# EAGLE design HW-DC25-Badge-20170609-1.2 (EAGLE 7.6.0)
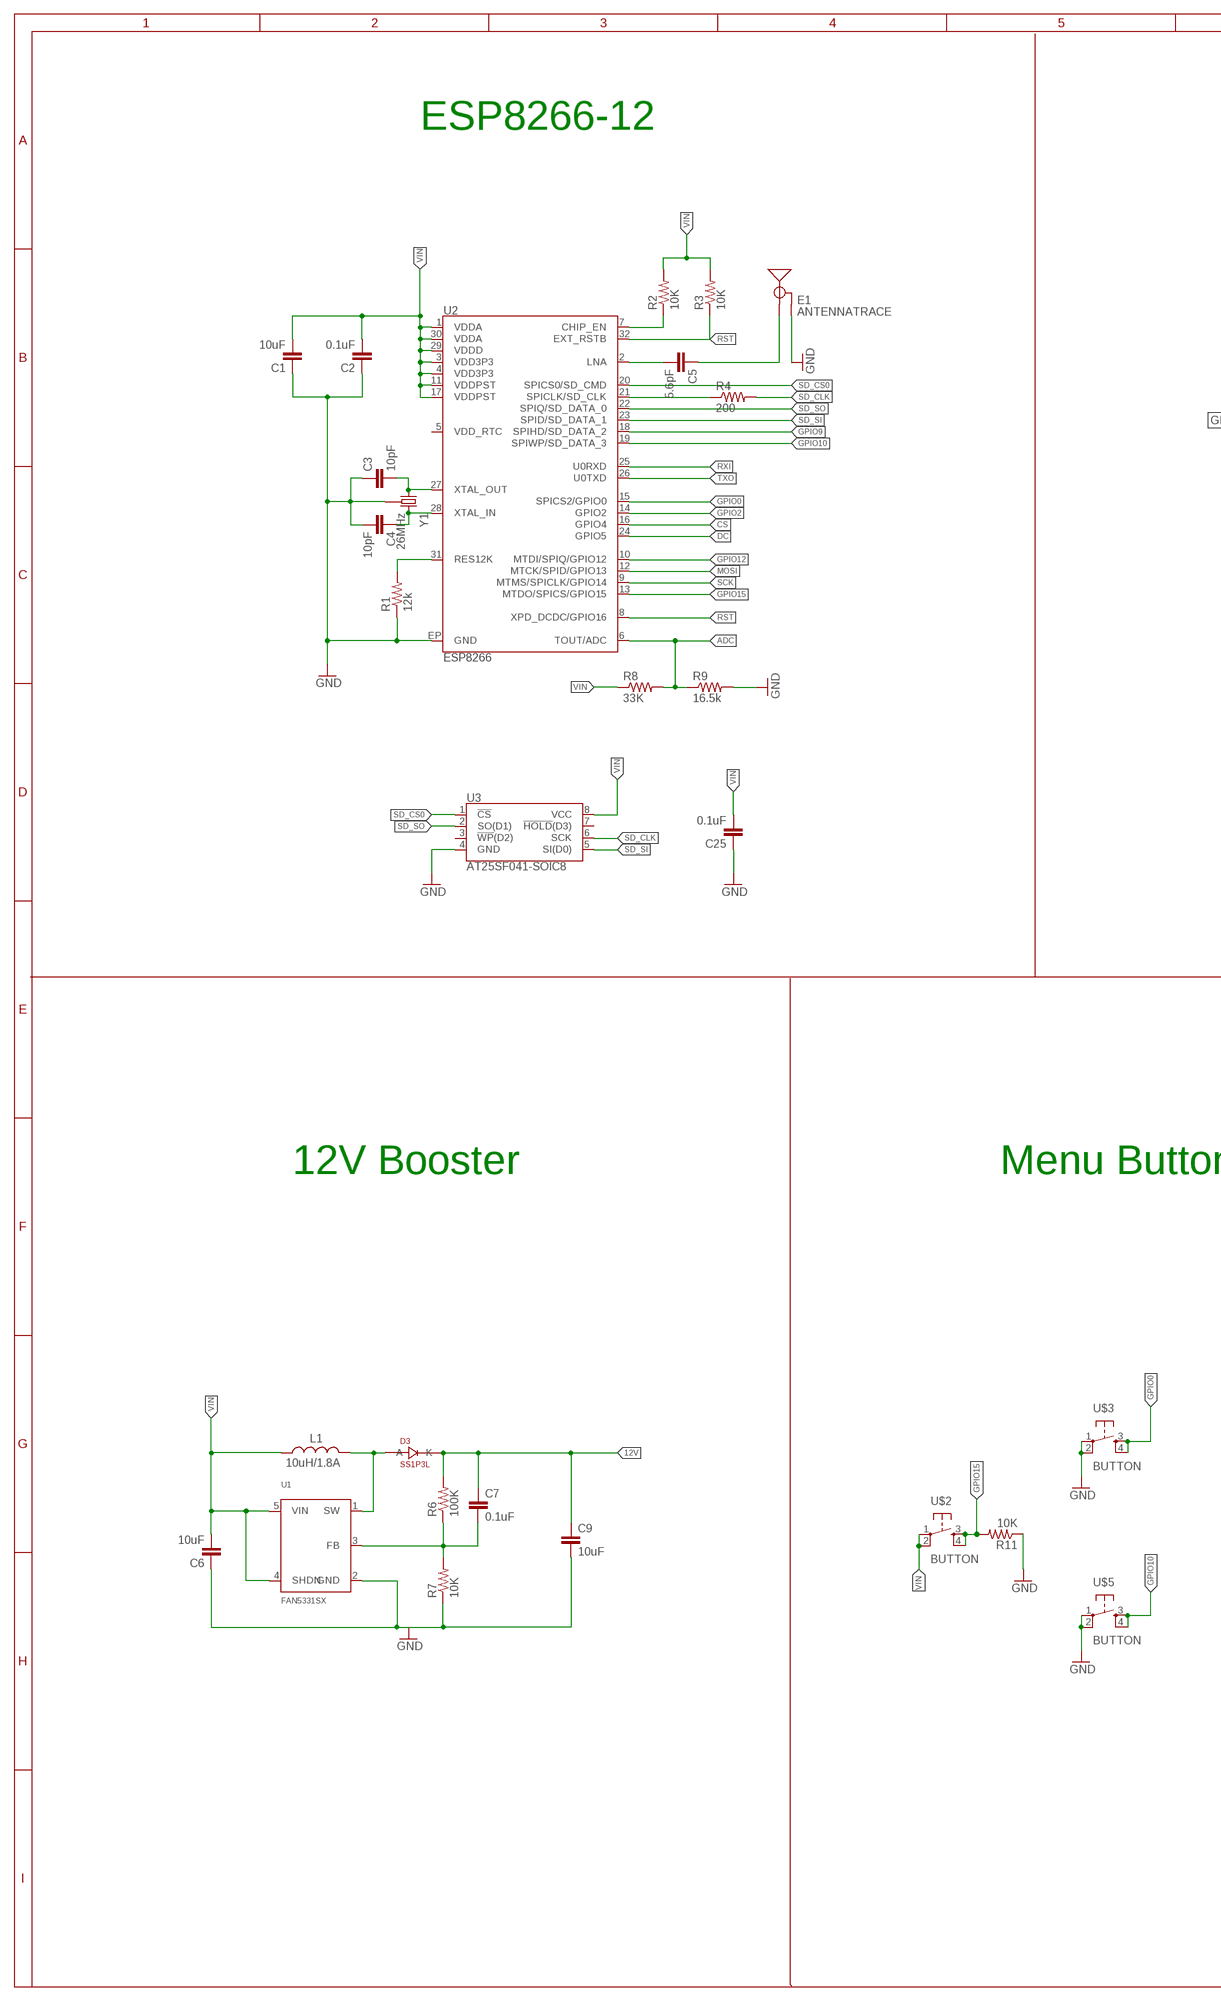
[diagram p0: schematic, sheet 1, part 1 of 2]
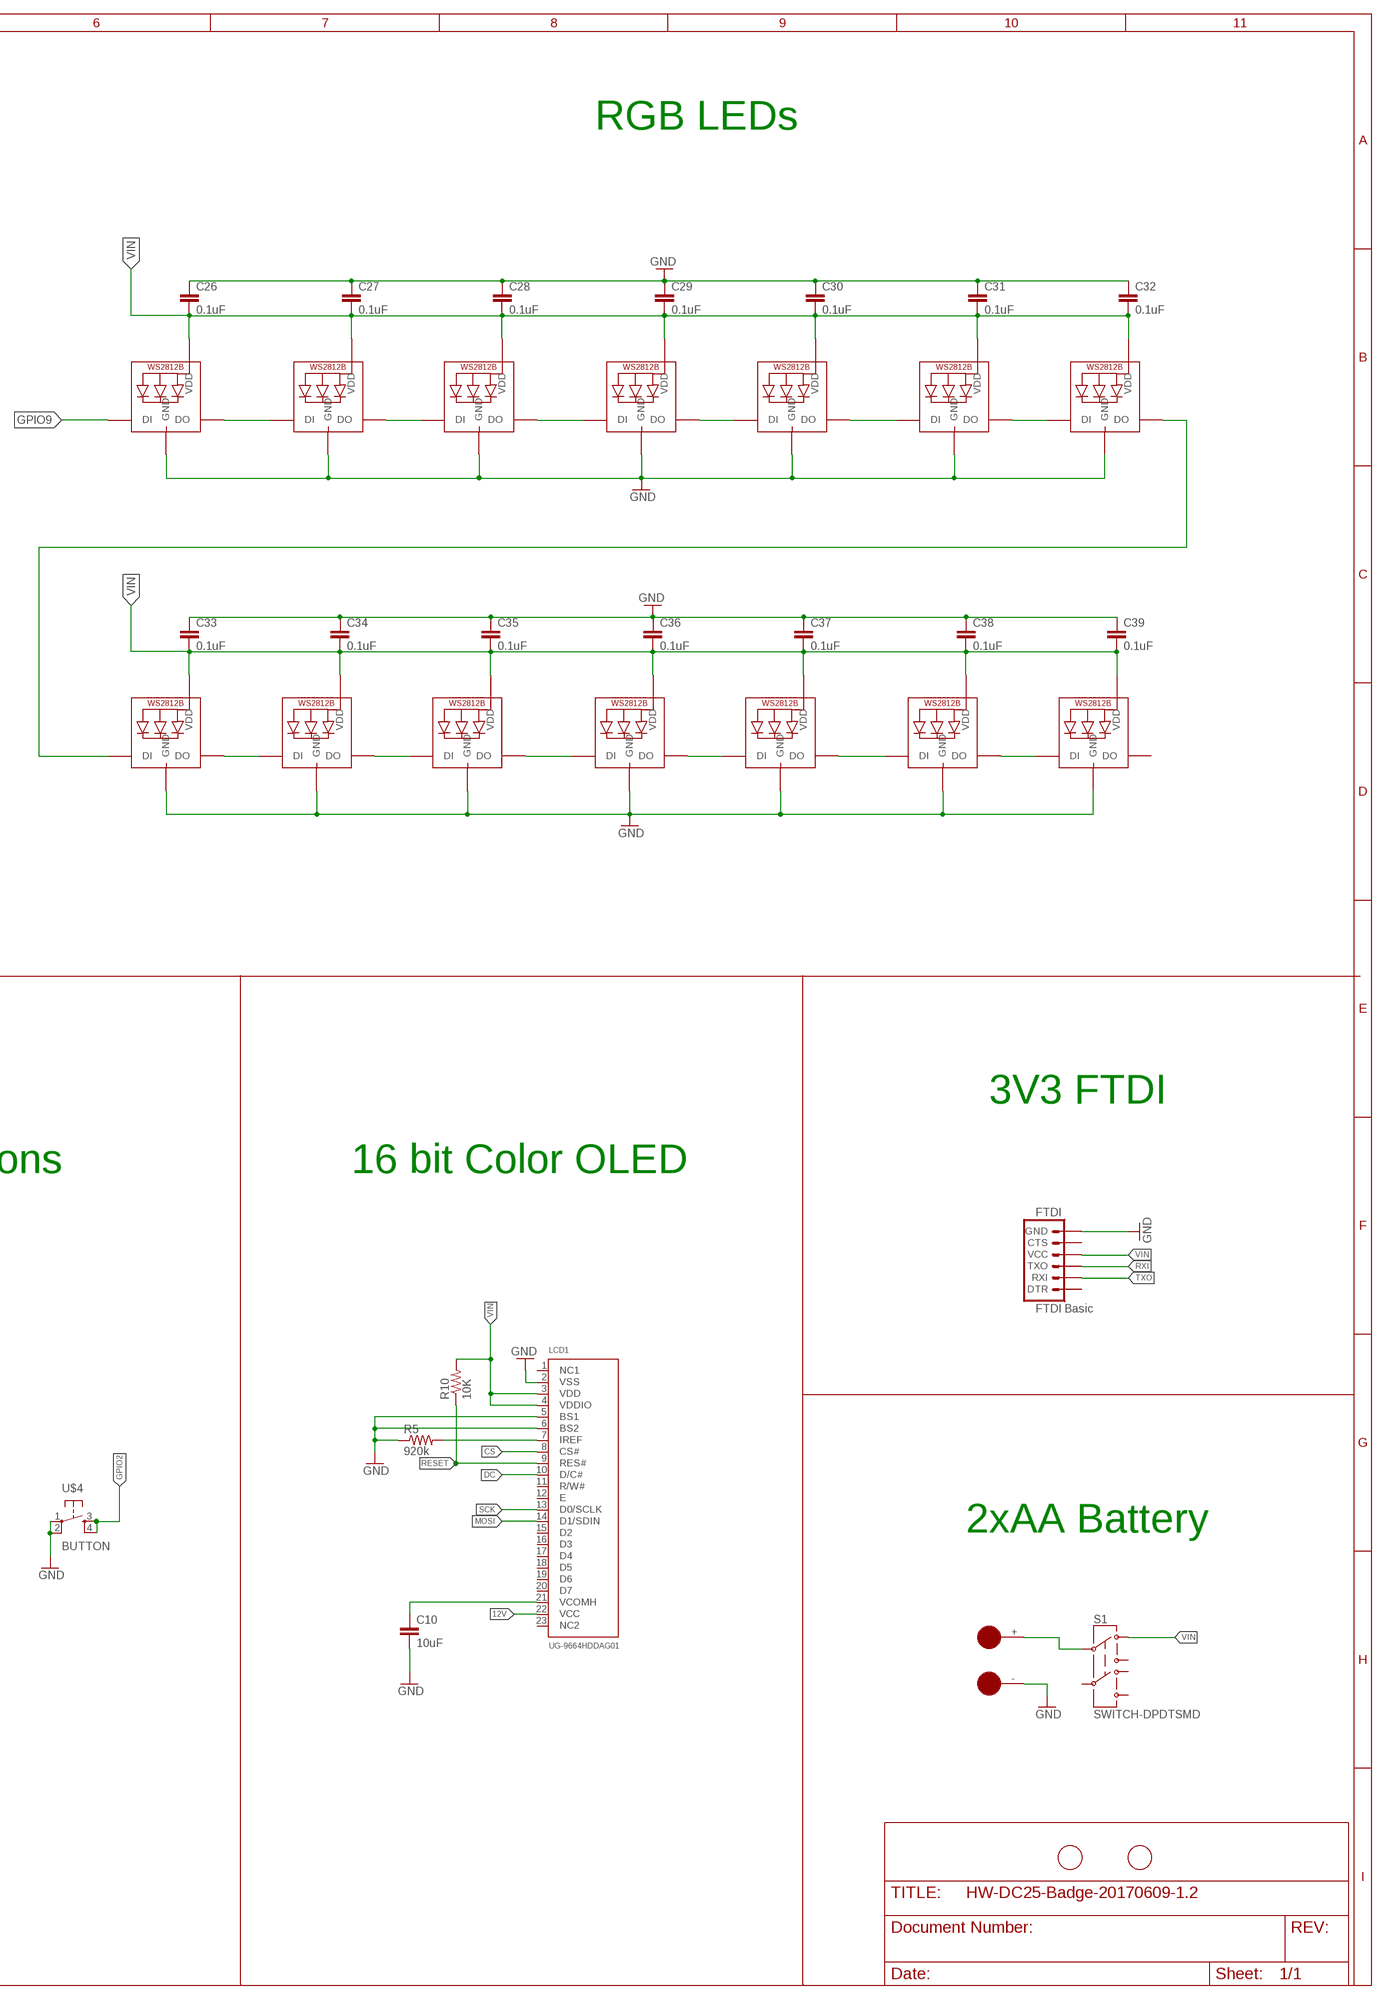
[diagram p1: schematic, sheet 1, part 2 of 2]

## Parts
C1  10uF  CAP-0603-10UF-10V-10%  [CAP0603]
C2  0.1uF  CAP-0603-10UF-10V-10%  [CAP0603]
C3  10pF  CAP-0603-0.01UF-50V-10%  [CAP0603]
C4  10pF  CAP-0603-0.01UF-50V-10%  [CAP0603]
C5  5.6pF  CAP-0603-EMPTY-VALUES  [CAP0603]
C6  10uF  CAP-0603-10UF-10V-10%  [CAP0603]
C7  0.1uF  CAP-0603-0.1UF-25V-10%  [CAP0603]
C9  10uF  CAP-0603-10UF-25V-20%  [CAP0603]
C10  10uF  CAP-0603-10UF-25V-20%  [CAP0603]
C25  0.1uF  CAP-0603-10UF-10V-10%  [CAP0603]
C26  0.1uF  CAP-0402-0.1UF-16V-10%  [CAP0402]
C27  0.1uF  CAP-0402-0.1UF-16V-10%  [CAP0402]
C28  0.1uF  CAP-0402-0.1UF-16V-10%  [CAP0402]
C29  0.1uF  CAP-0402-0.1UF-16V-10%  [CAP0402]
C30  0.1uF  CAP-0402-0.1UF-16V-10%  [CAP0402]
C31  0.1uF  CAP-0402-0.1UF-16V-10%  [CAP0402]
C32  0.1uF  CAP-0402-0.1UF-16V-10%  [CAP0402]
C33  0.1uF  CAP-0402-0.1UF-16V-10%  [CAP0402]
C34  0.1uF  CAP-0402-0.1UF-16V-10%  [CAP0402]
C35  0.1uF  CAP-0402-0.1UF-16V-10%  [CAP0402]
C36  0.1uF  CAP-0402-0.1UF-16V-10%  [CAP0402]
C37  0.1uF  CAP-0402-0.1UF-16V-10%  [CAP0402]
C38  0.1uF  CAP-0402-0.1UF-16V-10%  [CAP0402]
C39  0.1uF  CAP-0402-0.1UF-16V-10%  [CAP0402]
D3  SS1P3L  [DO220AAL]
E1  ANTENNATRACE  [TRACE_ANTENNA_2.4GHZ_25.7MM]
FTDI  FTDI Basic  ARDUINO_SERIAL_PROGRAMPTH  [1X06]
L1  10uH/1.8A  INDUCTORSRU5028  [SRU5028]
LCD1  UG-9664HDDAG01  DISP_OLED_UG-9664HDDAG01WRAPAROUND  [UG-9664HDDAG01_WRAPAROUND]
LED1  WS2812B3535  [LED3535]
LED2  WS2812B3535  [LED3535]
LED3  WS2812B3535  [LED3535]
LED4  WS2812B3535  [LED3535]
LED5  WS2812B3535  [LED3535]
LED6  WS2812B3535  [LED3535]
LED7  WS2812B3535  [LED3535]
LED8  WS2812B3535  [LED3535]
LED9  WS2812B3535  [LED3535]
LED10  WS2812B3535  [LED3535]
LED11  WS2812B3535  [LED3535]
LED12  WS2812B3535  [LED3535]
LED13  WS2812B3535  [LED3535]
LED14  WS2812B3535  [LED3535]
R1  12k  RES-0603_EMPTY-FIELDS  [RES-0603]
R2  10K  RES-0603-10K-5%  [RES-0603]
R3  10K  RES-0603-10K-5%  [RES-0603]
R4  200  RES-0603_EMPTY-FIELDS  [RES-0603]
R5  920k  RES-0603_EMPTY-FIELDS  [RES-0603]
R6  100K  RES-0603-100K-5%  [RES-0603]
R7  10K  RES-0603-10K-5%  [RES-0603]
R8  33K  RES-0603-33K-1%  [RES-0603]
R9  16.5k  RES-0603-10K-5%  [RES-0603]
R10  10K  RES-0603-10K-5%  [RES-0603]
R11  10K  RES-0603-10K-5%  [RES-0603]
S1  SWITCH-DPDTSMD  [AYZ0202]
U1  FAN5331SX  FAN5331  [SOT23-5]
U2  ESP8266  [QFN32]
U3  AT25SF041-SOIC8  [SO08]
U$1  BAT_HOLD  [AA]
U$2  BUTTON  [BUTTON]
U$3  BUTTON  [BUTTON]
U$4  BUTTON  [BUTTON]
U$5  BUTTON  [BUTTON]
U$6  FIDUCIAL  [FIDUCIAL_1MM]
U$7  FIDUCIAL  [FIDUCIAL_1MM]
Y1  26MHz  CRYSTAL-GROUNDED3.2X2.5  [CRYSTAL-SMD-3.2X2.5]

## Nets
12V: C7.1 C9.1 D3.P$1(K) LCD1.22(VCC) R6.2
ADC: R8.2 R9.1 U2.6(TOUT/ADC)
CS: LCD1.8(CS#) U2.16(GPIO4)
DC: LCD1.10(D/C#) U2.24(GPIO5)
GND: C1.1 C2.1 C3.1 C4.2 C6.1 C9.2 C10.2 C25.1 C26.P$1 C27.P$1 C28.P$1 C29.P$1 C30.P$1 C31.P$1 C32.P$1 C33.P$1 C34.P$1 C35.P$1 C36.P$1 C37.P$1 C38.P$1 C39.P$1 E1.GND E1.GND2(GND) FTDI.6(GND) LCD1.2(VSS) LCD1.5(BS1) LCD1.6(BS2) LED1.4(GND) LED2.4(GND) LED3.4(GND) LED4.4(GND) LED5.4(GND) LED6.4(GND) LED7.4(GND) LED8.4(GND) LED9.4(GND) LED10.4(GND) LED11.4(GND) LED12.4(GND) LED13.4(GND) LED14.4(GND) R1.1 R5.1 R7.1 R9.2 R11.1 U1.2(GND) U2.EP(GND) U3.4(GND) U$1.- U$3.1 U$3.2 U$4.1 U$4.2 U$5.1 U$5.2 Y1.2(GND) Y1.4(GND)
GPIO0: U2.15(SPICS2/GPIO0) U$3.3 U$3.4
GPIO2: U2.14(GPIO2) U$4.3 U$4.4
GPIO9: LED1.1(DI) U2.18(SPIHD/SD_DATA_2)
GPIO10: U2.19(SPIWP/SD_DATA_3) U$5.3 U$5.4
GPIO12: U2.10(MTDI/SPIQ/GPIO12)
GPIO15: R11.2 U2.13(MTDO/SPICS/GPIO15) U$2.3 U$2.4
MOSI: LCD1.14(D1/SDIN) U2.12(MTCK/SPID/GPIO13)
N$1: C3.2 U2.27(XTAL_OUT) Y1.1
N$2: C4.1 U2.28(XTAL_IN) Y1.3
N$3: C5.2 U2.2(LNA)
N$4: C5.1 E1.ANT(SIGNAL)
N$5: R1.2 U2.31(RES12K)
N$6: R2.1 U2.7(CHIP_EN)
N$7: D3.P$2(A) L1.2 U1.1(SW)
N$8: R4.1 U2.21(SPICLK/SD_CLK)
N$9: LCD1.7(IREF) R5.2
N$10: S1.2 U$1.+
N$11: C7.2 R6.1 R7.2 U1.3(FB)
N$12: C10.1 LCD1.21(VCOMH)
N$14: LED1.3(DO) LED2.1(DI)
N$15: LED2.3(DO) LED3.1(DI)
N$16: LED3.3(DO) LED4.1(DI)
N$17: LED4.3(DO) LED5.1(DI)
N$18: LED5.3(DO) LED6.1(DI)
N$19: LED6.3(DO) LED7.1(DI)
N$20: LED7.3(DO) LED8.1(DI)
N$21: LED8.3(DO) LED9.1(DI)
N$22: LED9.3(DO) LED10.1(DI)
N$23: LED10.3(DO) LED11.1(DI)
N$24: LED11.3(DO) LED12.1(DI)
N$25: LED12.3(DO) LED13.1(DI)
N$26: LED13.3(DO) LED14.1(DI)
RESET: LCD1.9(RES#) R10.1
RST: R3.1 U2.8(XPD_DCDC/GPIO16) U2.32(EXT_RSTB)
RXI: FTDI.3(TXO) U2.25(U0RXD)
SCK: LCD1.13(D0/SCLK) U2.9(MTMS/SPICLK/GPIO14)
SD_CLK: R4.2 U3.6(SCK)
SD_CS0: U2.20(SPICS0/SD_CMD) U3.1(!CS!)
SD_SI: U2.23(SPID/SD_DATA_1) U3.5(SI(D0))
SD_SO: U2.22(SPIQ/SD_DATA_0) U3.2(SO(D1))
TXO: FTDI.2(RXI) U2.26(U0TXD)
VIN: C1.2 C2.2 C6.2 C25.2 C26.P$2 C27.P$2 C28.P$2 C29.P$2 C30.P$2 C31.P$2 C32.P$2 C33.P$2 C34.P$2 C35.P$2 C36.P$2 C37.P$2 C38.P$2 C39.P$2 FTDI.4(VCC) L1.1 LCD1.3(VDD) LCD1.4(VDDIO) LED1.2(VDD) LED2.2(VDD) LED3.2(VDD) LED4.2(VDD) LED5.2(VDD) LED6.2(VDD) LED7.2(VDD) LED8.2(VDD) LED9.2(VDD) LED10.2(VDD) LED11.2(VDD) LED12.2(VDD) LED13.2(VDD) LED14.2(VDD) R2.2 R3.2 R8.1 R10.2 S1.1 U1.4(SHDN) U1.5(VIN) U2.1(VDDA) U2.3(VDD3P3) U2.4(VDD3P3) U2.11(VDDPST) U2.17(VDDPST) U2.29(VDDD) U2.30(VDDA) U3.8(VCC) U$2.1 U$2.2
Unconnected: FTDI.1(DTR) FTDI.5(CTS) LCD1.1(NC1) LCD1.11(R/W#) LCD1.12(E) LCD1.15(D2) LCD1.16(D3) LCD1.17(D4) LCD1.18(D5) LCD1.19(D6) LCD1.20(D7) LCD1.23(NC2) LED14.3(DO) S1.3 S1.4 S1.5 S1.6 U2.5(VDD_RTC) U3.3(!WP!(D2)) U3.7(!HOLD!(D3))

## Notes on the sheet
- ESP8266-12 | RGB LEDs
- 3V3 FTDI
- 12V Booster | Menu Buttons | 16 bit Color OLED
- 2xAA Battery

## Library data of the parts
C1 C6 = Jaycon OPL Capacitors:CAP-0603: Jaycon Systems OPL Capacitors 0603 Package. The name for the part has the Value - Voltage - Tolerance making part selection simple.; JAYCON: CP-0070; MFG#1: GRM188R61A106KE69D; SIZE: 0603; TEMPERATURE-COEFFICIENT: X5R; TOLERANCE: 10%; VOLTAGE: 10V
C2 C25 = Jaycon OPL Capacitors:CAP-0603: Jaycon Systems OPL Capacitors 0603 Package. The name for the part has the Value - Voltage - Tolerance making part selection simple.; JAYCON: CP-0070; MFG#1: GRM188R61A106KE69D; SIZE: 0603; TEMPERATURE-COEFFICIENT: X5R; TOLERANCE: 10%; VALUE: 10uF; VOLTAGE: 10V
C3 C4 = Jaycon OPL Capacitors:CAP-0603: Jaycon Systems OPL Capacitors 0603 Package. The name for the part has the Value - Voltage - Tolerance making part selection simple.; JAYCON: CP-0032; MFG#1: CC0603KPX7R9BB103; SIZE: 0603; TEMPERATURE-COEFFICIENT: X7R; TOLERANCE: 10%; VALUE: 0.01uF; VOLTAGE: 50V
C5 = Jaycon OPL Capacitors:CAP-0603: Jaycon Systems OPL Capacitors 0603 Package. The name for the part has the Value - Voltage - Tolerance making part selection simple.; SIZE: 0603
C7 = Jaycon OPL Capacitors:CAP-0603: Jaycon Systems OPL Capacitors 0603 Package. The name for the part has the Value - Voltage - Tolerance making part selection simple.; JAYCON: CP-0066; MFG#1: C1608X7R1E104KT; SIZE: 0603; TEMPERATURE-COEFFICIENT: X7R; TOLERANCE: 10%; VOLTAGE: 25V
C9 C10 = Jaycon OPL Capacitors:CAP-0603: Jaycon Systems OPL Capacitors 0603 Package. The name for the part has the Value - Voltage - Tolerance making part selection simple.; JAYCON: CP-0044; MFG#1: CL10A106MA8NRNC; SIZE: 0603; TEMPERATURE-COEFFICIENT: X5R; TOLERANCE: 20%; VOLTAGE: 25V
C26-C39 = Jaycon OPL Capacitors:CAP-0402: Jaycon Systems OPL Capacitors 0402 Package. The name for the part has the Value - Voltage - Tolerance making part selection simple.; JAYCON: CP-0028; MFG#1: GRM155R71C104KA88D; MFG#2: CL05B104KO5NNNC; SIZE: 0402; TEMPERATURE-COEFFICIENT: X7R; TOLERANCE: 10%; VOLTAGE: 16V
D3 = SmartPrj:SS1P3L; OC_NEWARK: unknown
E1 = SparkFun-RF:ANTENNA: Chip antenna Chip antenna with ground or secondary connection. Common with larger metal RF connectors.
FTDI = SparkFun:ARDUINO_SERIAL_PROGRAM
L1 = SparkFun:INDUCTOR: Inductors Basic Inductor/Choke - 0603 and 1206. Footprints are not proven and vary greatly between part numbers.
LCD1 = microbuilder:DISP_OLED_UG-9664HDDAG01: OLED 96x64 Pixel, 0.95" 65K Color
LED1-LED14 = adafruit:WS2812B
R1 R4 R5 = Jaycon OPL Resistors:RES-0603: SMD 0603 Resistor Library; SIZE: 0603; WATTAGE: 0.1W
R2 R3 R7 R10 R11 = Jaycon OPL Resistors:RES-0603: SMD 0603 Resistor Library; JAYCON: RS-0027; ROHM-MFG: MCR03EZPJ103; SAMSUNG-MFG: RC1608J103CS; SIZE: 0603; TOLERANCE: 5%; VISHAY-MFG: CRCW060310K0JNEA; WATTAGE: 0.1W; YAGEO-MFG: RC0603JR-0710KP
R6 = Jaycon OPL Resistors:RES-0603: SMD 0603 Resistor Library; JAYCON: RS-0013; SIZE: 0603; TOLERANCE: 5%; VISHAY-MFG: RCG0603100KJNEA; WATTAGE: 0.1W
R8 = Jaycon OPL Resistors:RES-0603: SMD 0603 Resistor Library; JAYCON: RS-0014; SIZE: 0603; TOLERANCE: 1%; WATTAGE: 0.1W; YAGEO-MFG: RC0603FR-0733KL
R9 = Jaycon OPL Resistors:RES-0603: SMD 0603 Resistor Library; JAYCON: RS-0027; ROHM-MFG: MCR03EZPJ103; SAMSUNG-MFG: RC1608J103CS; SIZE: 0603; TOLERANCE: 5%; VALUE: 10K; VISHAY-MFG: CRCW060310K0JNEA; WATTAGE: 0.1W; YAGEO-MFG: RC0603JR-0710KP
S1 = SparkFun:SWITCH-DPDT: DPDT Version of the COM-00597
U1 = microbuilder:FAN5331: FAN5331 - LED/OLED 20V Boost Converter Digikey: FAN5331SXCT-ND
U2 = esp8266-development-board:ESP8266: Espressif ESP8266 WiFi Smart Connectivity Platform.; PROD_ID: IC-12452
U3 = esp8266-development-board:AT25SF041: SPI Serial Flash Memory with Dual/Quad-IO Support Example: Adesto Technologies AT25SF041-SSHD-T (1265-1131-1-ND) <http://www.digikey.com/product-detail/en/AT25SF041-SSHD-T/1265-1131-1-ND/4824165>; PROD_ID: IC-12455
U$1 = Badge:BAT_HOLD
U$2-U$5 = WiFiButton:BUTTON
U$6 U$7 = adafruit:FIDUCIAL: For use by pick and place machines to calibrate the vision/machine, 1mm By microbuilder.eu
Y1 = things:CRYSTAL-GROUNDED; PROD_ID: XTAL-12454

## Board
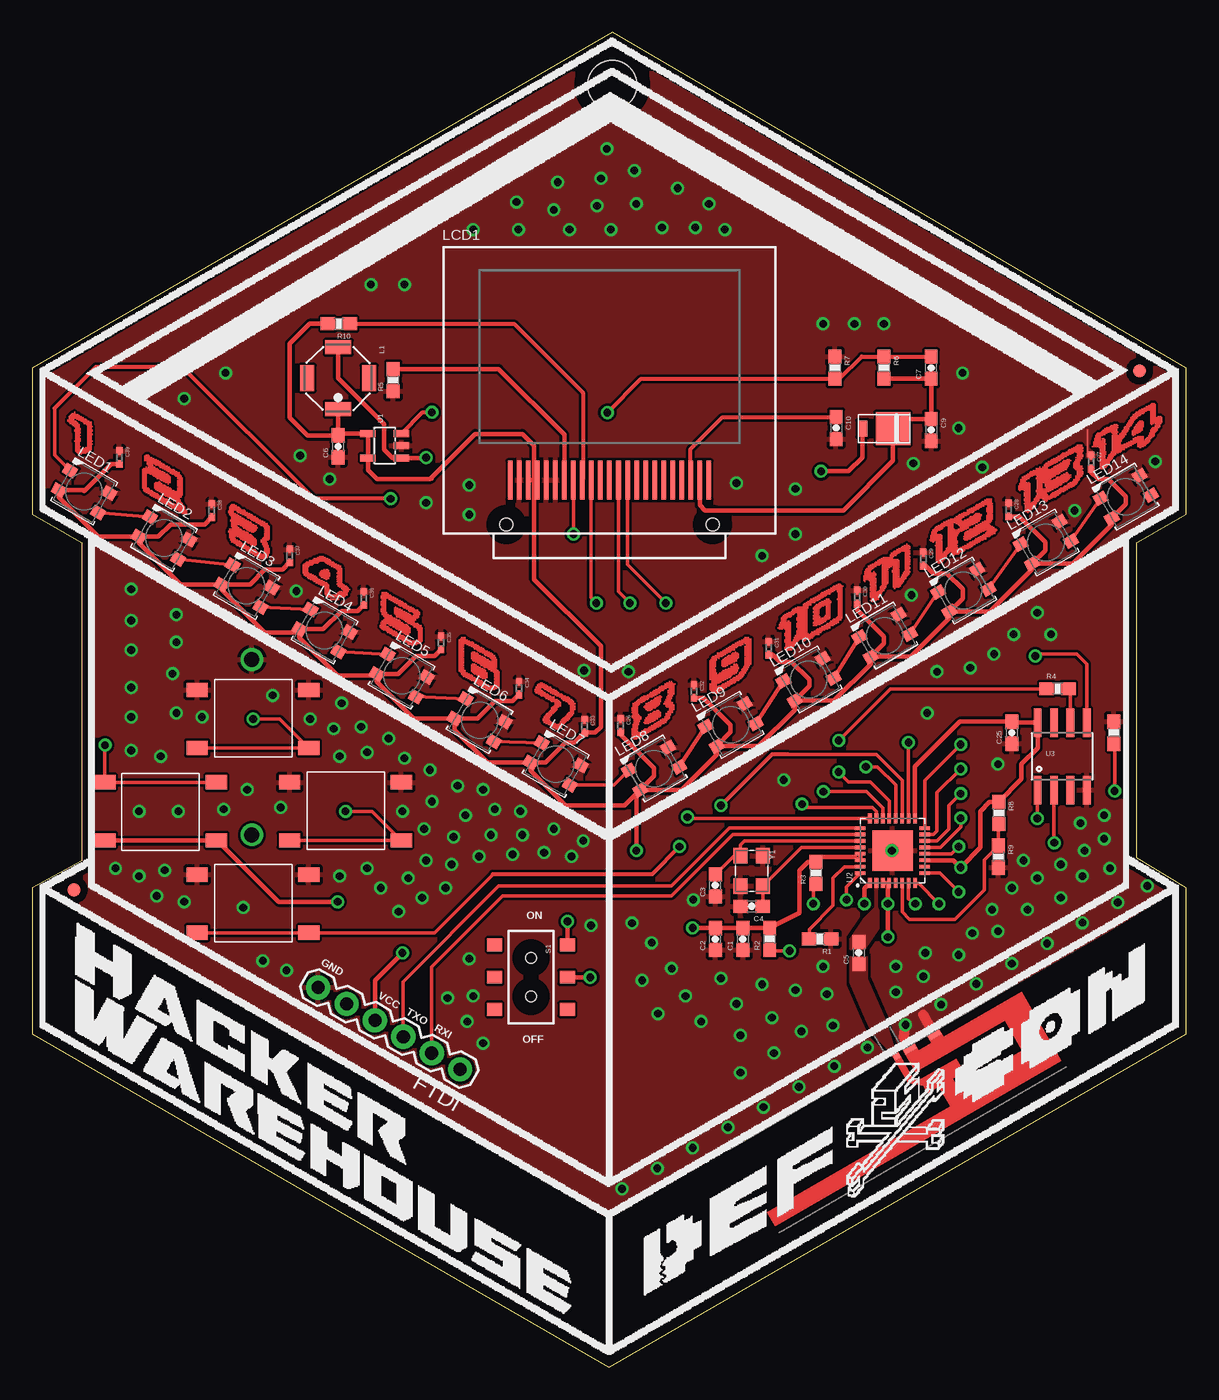
[diagram p2: board, top side]
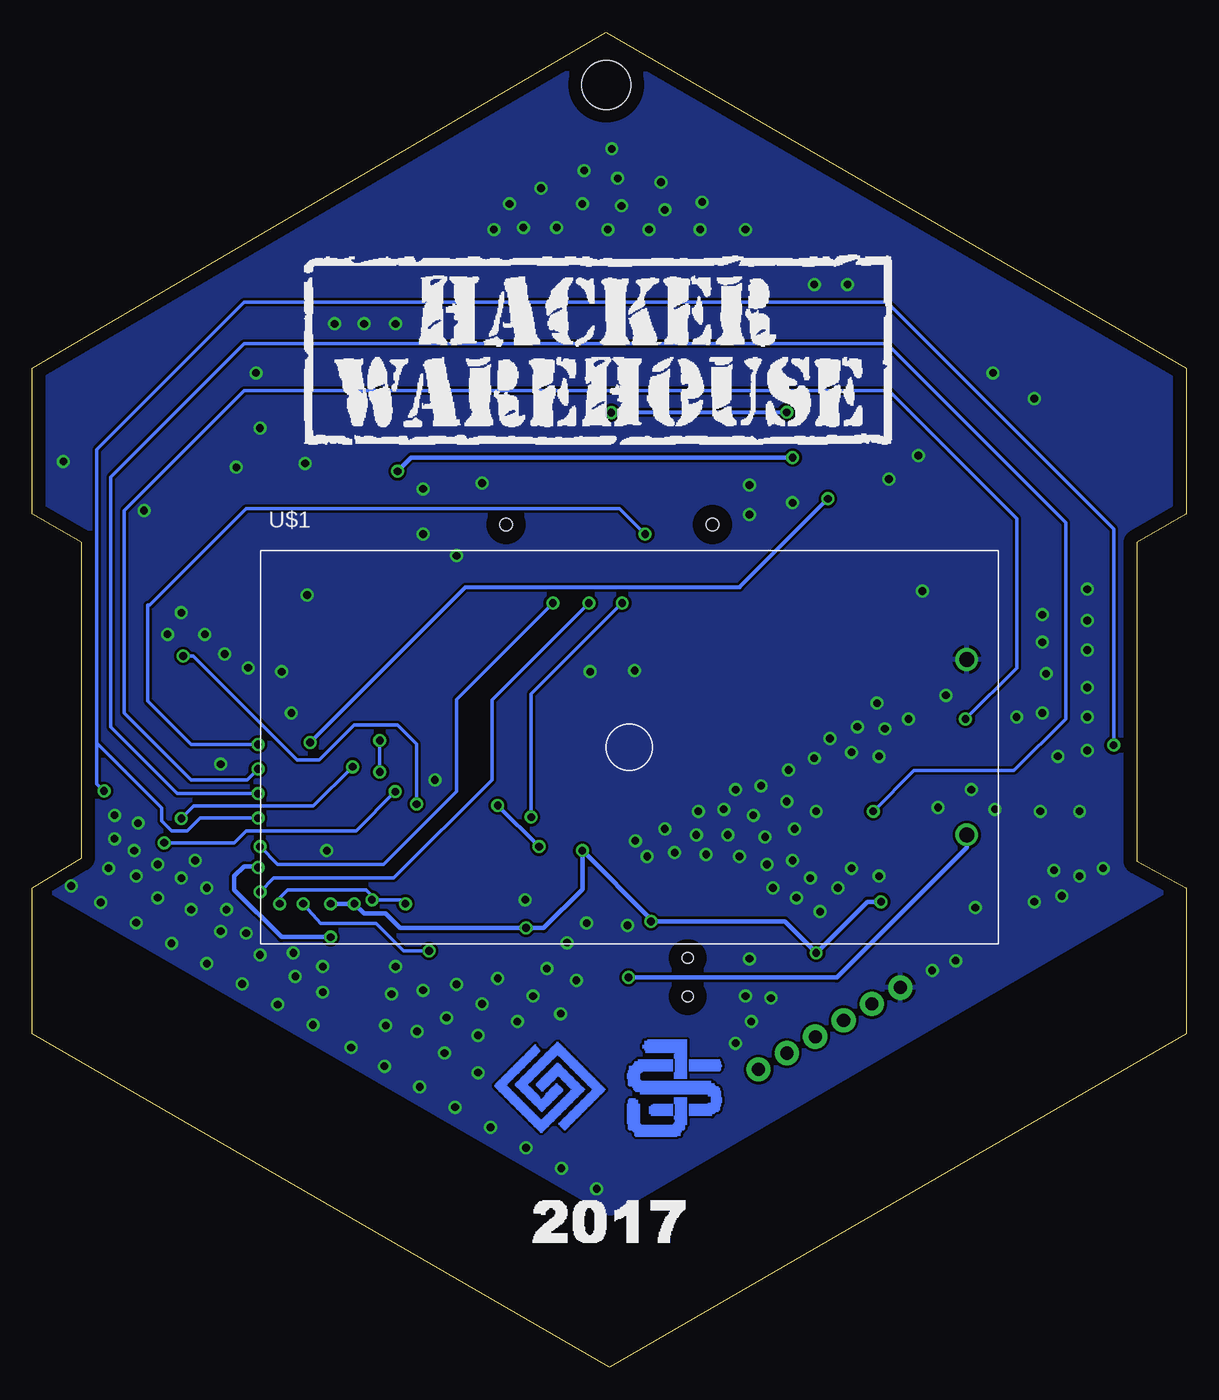
[diagram p3: board, bottom side, seen from below]

Size 89.48 x 103.5 mm. Coordinates in mm from the lower left corner, seen from the top.
Outline: 89.48,66.14 89.48,77.47 44.98,103.51 0,77.47 0,66.14 3.84,63.93 3.84,39.27 0,37.16 0,25.83 44.73,0 89.48,25.83 89.48,37.16 85.65,39.47 85.65,63.93 89.48,66.14
Copper layers (1*16): Top 0.035mm / dielectric 1.5mm / Bottom 0.035mm
Design rules "default *": minimum track width 10mil, minimum drill 24mil, track to track 8mil, track to pad 8mil, pad to pad 8mil, via to via 8mil, smd to smd 8mil, copper to edge 40mil, drill to drill 8mil, minimum pad ring 10mil, minimum via ring 8mil, stop-mask expansion 4mil, vias tented up to drill 24mil, thermal gap 10mil
Holes 3.81 mm at 44.98,99.43

### Footprints (pad centres in the part's own frame; a part is rotated, then mirrored left to right if it is on the bottom)
CAP0603 = smd 1.1 x 1: 1 -0.85,0; 2 0.85,0
CAP0402 = smd 0.599 x 0.5: P$1 -0.5,0; P$2 0.5,0
DO220AAL = smd 2.667 x 2.54: P$1 -0.7,0 | smd 0.762 x 1.27: P$2 1.65,0
TRACE_ANTENNA_2.4GHZ_25.7MM = smd 0.46 x 0.46: ANT 0,0.23 | smd 1 x 0.46: GND -1.18,0.23; GND2 -3.38,0.23
1X06 = drill 1.016 pad 1.88: 1 0,0; 2 2.54,0; 3 5.08,0; 4 7.62,0; 5 10.16,0; 6 12.7,0
SRU5028 = smd 1.1 x 2: 1 2.4,0; 2 -2.4,0 | smd 2 x 1.1: P$1 0,2.4; P$2 0,-2.4
UG-9664HDDAG01_WRAPAROUND = smd 0.35 x 3: 1 -7.7,4.138; 2 -7,4.138; 3 -6.3,4.138; 4 -5.6,4.138; 5 -4.9,4.138; 6 -4.2,4.138; 7 -3.5,4.138; 8 -2.8,4.138; 9 -2.1,4.138; 10 -1.4,4.138; 11 -0.7,4.138; 12 0,4.138; 13 0.7,4.138; 14 1.4,4.138; 15 2.1,4.138; 16 2.8,4.138; 17 3.5,4.138; 18 4.2,4.138; 19 4.9,4.138; 20 5.6,4.138; 21 6.3,4.138; 22 7,4.138; 23 7.7,4.138 | hole 1: -8,0.688; 8,0.688
LED3535 = smd 1 x 0.85: 1 -1.75,0.875; 2 -1.75,-0.875; 3 1.75,-0.875; 4 1.75,0.875
RES-0603 = smd 1.1 x 1: 1 -0.85,0; 2 0.85,0
AYZ0202 = smd 1 x 1.15: 1 -2.5,2.825; 2 0,2.825; 3 2.5,2.825; 4 -2.5,-2.825; 5 0,-2.825; 6 2.5,-2.825 | hole 0.85: 1.5,0; -1.5,0
SOT23-5 = smd 0.55 x 1.2: 1 -0.95,-1.3; 2 0,-1.3; 3 0.95,-1.3; 4 0.95,1.3; 5 -0.95,1.3
QFN32 = smd 0.8 x 0.285: 1 -2.5,1.75; 2 -2.5,1.25; 3 -2.5,0.75; 4 -2.5,0.25; 5 -2.5,-0.25; 6 -2.5,-0.75; 7 -2.5,-1.25; 8 -2.5,-1.75; 17 2.5,-1.75; 18 2.5,-1.25; 19 2.5,-0.75; 20 2.5,-0.25; 21 2.5,0.25; 22 2.5,0.75; 23 2.5,1.25; 24 2.5,1.75 | smd 0.285 x 0.8: 9 -1.75,-2.5; 10 -1.25,-2.5; 11 -0.75,-2.5; 12 -0.25,-2.5; 13 0.25,-2.5; 14 0.75,-2.5; 15 1.25,-2.5; 16 1.75,-2.5; 25 1.75,2.5; 26 1.25,2.5; 27 0.75,2.5; 28 0.25,2.5; 29 -0.25,2.5; 30 -0.75,2.5; 31 -1.25,2.5; 32 -1.75,2.5 | smd 3.15 x 3.15: EP 0,0
SO08 = smd 0.61 x 2.21: 1 -1.905,-2.616; 2 -0.635,-2.616; 3 0.635,-2.616; 4 1.905,-2.616; 5 1.905,2.616; 6 0.635,2.616; 7 -0.635,2.616; 8 -1.905,2.616
AA = drill 1.17: + 26.16,-6.795; - 26.16,6.795
BUTTON = smd 1.65 x 1.1: 1 -4.325,2.25; 2 4.325,2.25; 3 -4.325,-2.25; 4 4.325,-2.25
FIDUCIAL_1MM = smd 1 x 1: 1 0,0
CRYSTAL-SMD-3.2X2.5 = smd 1.2 x 1.1: 1 -1.175,-0.875; 2 1.175,-0.875; 3 1.175,0.875; 4 -1.175,0.875

### Placement (x,y rotation side)
C1  55.09,33.2 90 top
C2  52.96,33.2 90 top
C3  52.96,37.36 90 top
C4  55.78,35.74 180 top
C5  64.08,32.13 90 top
C6  23.72,71.4 90 top
C7  69.7,77.5 90 top
C9  69.7,72.67 270 top
C10  62.33,72.82 270 top
C25  75.95,49.2 90 top
C26  45.62,49.76 270 top
C27  82.09,70.18 270 top
C28  75.69,66.47 270 top
C29  69.09,62.66 270 top
C30  63.96,59.72 270 top
C31  57.1,55.75 270 top
C32  51.31,52.4 270 top
C33  42.82,49.71 270 top
C34  37.74,52.65 270 top
C35  31.7,56.16 270 top
C36  25.7,59.61 270 top
C37  19.96,62.92 270 top
C38  13.92,66.42 270 top
C39  6.76,70.54 270 top
D3  66.04,72.77 180 top
E1  66.9,24.31 210 top
FTDI  33.17,23.09 150 top
L1  23.72,76.68 270 top
LCD1  44.75,64.64 0 top
LED1  4.01,67.89 330 top
LED2  10.21,64.29 330 top
LED3  16.61,60.58 330 top
LED4  22.66,57.12 330 top
LED5  28.65,53.62 330 top
LED6  34.7,50.17 330 top
LED7  40.59,46.76 330 top
LED8  48.21,46.41 30 top
LED9  54.15,49.81 30 top
LED10  60.2,53.31 30 top
LED11  66.09,56.72 30 top
LED12  72.19,60.22 30 top
LED13  78.59,63.93 30 top
LED14  84.79,67.49 30 top
R1  61.09,33.2 180 top
R2  57.18,33.2 90 top
R3  60.76,38.33 90 top
R4  79.5,52.6 0 top
R5  27.99,76.53 90 top
R6  66.04,77.5 270 top
R7  62.23,77.5 270 top
R8  74.94,42.97 270 top
R9  74.91,39.58 270 top
R10  23.77,80.9 180 top
R11  83.87,49.2 270 top
S1  38.67,30.25 270 top
U1  27.33,71.45 90 top
U2  66.7,40.06 90 top
U3  79.86,47.37 0 top
U$1  43.19,48.07 0 bottom
U$2  9.96,43.1 180 top
U$3  17.12,50.27 0 top
U$4  24.28,43.1 0 top
U$5  17.12,35.94 0 top
U$6  3.25,37.01 90 top
U$7  85.85,77.24 90 top
Y1  55.78,38.48 270 top

### Tracks (layer width: path | path; a pad name or v marks a point on that pad's centre or on a via)
12V
  Top 0.305: D3.P$1
  Top 0.356: R6.2 C7.1 C9.1 67.49,73.52 D3.P$1 67.06,73.09 | LCD1.22 51.76,66.84 52.17,66.42 62.88,66.42 66.74,70.28 D3.P$1
ADC
  Top 0.254: U2.6 67.45,35.29 68.02,34.72 71.53,34.72 73.81,37.01 73.81,39.33 R9.1 74.91,42.1 R8.2
CS  (via drill 0.6)
  Top 0.254: U2.16 69.2,45.5 v71.98,48.29 | v41.96,64.59 LCD1.8
  Bottom 0.254: v71.98,48.29 77.17,48.29 80.52,51.64 80.52,59.11 80.37,59.11 72.9,66.57 43.94,66.57 v41.96,64.59
DC  (via drill 0.6)
  Top 0.254: U2.24 50.89,42.56 v50.8,42.65 | LCD1.10 43.33,68.76 43.33,59.66 v43.74,59.26
  Bottom 0.254: v50.8,42.65 50.8,52.2 v43.74,59.26
GND  (via drill 0.6)
  Top 0.152: C27.P$1 81.84,70.68 81.84,72.67
  Top 0.762: E1.GND2 69.09,27.33 | E1.GND 67.56,25.58 v67.72,26.54
  other vias: 66.65,40.06 74.88,46.76 42.77,54.03 46.23,53.92 73.66,69.77 80.82,66.42 68.17,59.87 20.47,60.17 51.26,36.25 86.46,37.31 84.18,36.04 81.43,34.47 78.69,32.87 75.95,31.29 73.2,29.72 64.77,24.79 62.18,23.34 56.69,20.17 53.95,18.59 51.21,17.02 48.46,15.42 70.46,28.12 59.44,21.74 45.72,13.84 81.28,42.19 83.11,42.8 83.11,40.97 81.58,40.06 83.57,38.68 81.43,38.07 79.76,38.99 76.86,39.29 77.93,37.92 79.76,36.4 75.95,37.16 77.17,35.48 74.42,35.48 74.88,33.81 72.9,33.66 71.83,31.98 69.24,32.13 69.09,30.3 66.95,31.06 66.95,29.08 61.32,31.06 59.18,29.24 59.64,26.04 61.62,28.93 46.5,34.43 34.95,25.12 33.73,26.8 32.21,28.63 34.19,28.78 33.88,31.67 43.33,34.26 42.72,40.82 40.44,41.73 38,41.28 39.67,39.9 41.81,39.6 37.85,43.1 35.86,43.26 32.97,45.09 33.58,42.8 35.56,41.28 34.65,39.6 37.24,39.75 32.66,41.12 30.53,39.29 32.51,38.99 32.05,37.16 30.23,36.4 29.16,37.92 25.96,38.68 27.03,37.16 28.4,35.33 23.83,38.07 30.38,41.73 28.7,43.1 30.99,43.87 30.84,46.3 34.95,44.78 28.85,47.22 27.64,48.74 25.5,49.66 25.96,47.68 23.83,47.37 23.37,49.5 21.54,50.27 23.98,51.49 17.88,31.52 19.71,30.76 6.45,38.68 8.28,38.07 10.26,38.53 11.79,36.09 9.65,36.55 8.28,43.1 11.33,43.1 16.36,35.64 16.66,44.78 19.25,43.41 14.83,43.26 7.67,47.83 9.96,47.37 7.67,50.42 7.67,52.7 7.67,55.6 7.67,57.89 7.67,60.33 11.18,58.34 11.18,56.21 10.87,53.77 11.18,50.72 13.16,50.42 18.64,52.1 14.99,77.09 11.79,75.11 26.26,83.95 28.85,83.95 20.78,70.69 23.06,68.86 30.53,67.03 33.88,68.4 33.88,66.12 54.61,68.55 59.18,68.1 59.18,64.59 56.59,62.92 68.33,70.08 71.83,72.82 72.14,77.09 61.32,80.9 63.75,80.9 66.04,80.9 87.07,70.23 34.19,88.21 37.69,88.21 41.66,88.21 44.86,88.21 48.82,88.37 51.41,88.37 53.7,88.21 50.04,91.41 46.69,92.79 44.55,94.46 44.09,92.18 43.79,90.04 40.74,91.87 37.54,90.35 40.44,89.74 46.84,90.2 52.48,90.2 70.15,53.92 69.39,50.72 72.75,54.23 74.57,55.3 76.1,56.82 78.99,56.82 77.93,58.5 58.27,45.54 48.02,32.91 57.51,24.36 57.35,27.1 56.59,29.69 53.39,30.15 54.61,28.17 54.91,25.73 54.91,22.83 51.87,26.8 50.65,28.78 49.58,30.91 47.29,30 48.51,27.41 62.08,26.49
  pour Top (rank 6): -5.89,106.35 -4.61,40.75 44.7,11.71 44.86,11.86 83.41,33.96 93.93,40.36 92.86,89.28 77.01,105.13
  pour Bottom (rank 6): -5.89,106.35 -4.69,40.58 44.7,11.86 93.93,40.21 92.86,90.35 76.86,106.35
GPIO0  (via drill 0.6)
  Top 0.254: U2.15 69.88,41.31 70.16,41.58 70.16,44.55 v71.98,46.38 | U$3.3 U$3.4 19.19,50.27 v17.12,50.27
  Bottom 0.254: v17.12,50.27 13.16,54.23 13.16,65.81 23.06,75.72 73.05,75.72 82.35,66.42 82.35,50.72 80.67,49.05 80.44,48.82 77.17,45.54 72.82,45.54 v71.98,46.38
GPIO2  (via drill 0.6)
  Top 0.254: U2.14 70.14,40.81 71.07,41.73 71.07,43.56 v71.98,44.48 | U$4.3 U$4.4 26.36,43.1 v24.28,43.1
  Bottom 0.254: v71.98,44.48 78.23,44.48 83.41,49.66 83.41,69.01 73.05,79.38 23.22,79.38 9.35,65.51 9.35,50.27 13.36,46.25 21.14,46.25 v24.28,43.1
GPIO9  (via drill 0.6)
  Top 0.254: U2.18 v67.95,48.43 v67.95,48.44 | LED1.1 1.73,70.74 1.73,74.35
  Top 0.305: 1.73,74.35 4.93,77.55 11.63,77.55 21.84,67.34 v27.79,67.34
  Bottom 0.305: v67.95,48.44 55.91,60.48 34.65,60.48 v27.79,67.34
GPIO10  (via drill 0.6)
  Top 0.254: U$5.3 U$5.4 31.18,33.69 35.71,38.23 | 58.57,47.52 65.44,47.52 67.46,45.5 67.46,42.57 U2.19
  Top 0.305: 58.57,47.52 57.35,47.52 v53.39,43.56 | v50.19,40.36 48.06,38.23 35.71,38.23
  Bottom 0.305: v53.39,43.56 v50.19,40.36
GPIO15  (via drill 0.6)
  Top 0.254: U2.13 70.41,40.31 71.98,41.88 v71.98,42.57 | U$2.3 U$2.4 v5.63,48.23 v5.64,48.23 5.69,48.29 | R11.2 83.92,48.3 v83.92,44.68
  Bottom 0.254: 72.01,42.55 v71.98,42.57 76.48,42.57 77.47,41.58 78.69,41.58 79.45,42.34 79.45,43.36 84.48,48.39 | v5.64,48.23 5.64,65 23.22,82.58 73.05,82.58 84.48,71.15 84.48,48.39 | v83.92,44.68 84.48,45.24 84.48,48.39
MOSI  (via drill 0.6)
  Top 0.254: U2.12 71.28,39.81 v71.83,40.36 | LCD1.14 46.16,62.23 v49.12,59.26
  Bottom 0.254: v71.83,40.36 70.46,38.99 62.23,38.99 56.59,44.63 56.59,51.79 v49.12,59.26
N$1
  Top 0.254: U2.27 55.21,40.81 54.92,40.51 54.92,39.67 Y1.1 | 55.06,39.81 Y1.1 | Y1.1 54.4,39.66 C3.2
N$2
  Top 0.254: U2.28 59.65,40.31 Y1.3 56.65,35.76 C4.1
N$3
  Top 0.254: U2.2 65.46,37.54 65.43,37.51 arc-90 65.46,37.49
  pour Top (no thermals): 65.3,37.67 65.3,35.61 64.44,34.75 63.4,33.22 63.37,33.2 63.37,32.44 63.4,32.41 64.57,32.41 65.66,33.99 65.68,34.01 65.68,35.43 65.58,35.61 65.58,37.67
N$4
  pour Top (no thermals): 64.8,31.83 63.35,31.83 63.35,29.82 64.39,27.41 65.05,25.91 66.5,24.49 67.03,23.62 67.44,23.88 66.8,24.97 66.27,26.75 64.8,30.12
N$5
  Top 0.254: U2.31 62.96,38.81 62.08,37.92 62.08,35.79 60.25,33.96 60.25,33.21 R1.2
N$6  (via drill 0.6)
  Top 0.254: U2.7 67.95,36.32 v68.48,35.94 | v58.73,32.28 57.24,32.28 arc-90 R2.1
  Bottom 0.254: v68.48,35.94 67.41,34.72 67.11,34.42 62.84,34.42 60.71,32.28 v58.73,32.28
N$7  (via drill 0.6)
  Top 0.356: L1.2 23.72,76.68 27.28,73.13 27.28,71.15 27.93,70.5 U1.1 30.5,70.5 v30.53,70.54 | v61.16,69.47 63.3,69.47 64.36,70.54 64.36,72.74 D3.P$2
  Bottom 0.356: v30.53,70.54 60.1,70.54 v61.16,69.47
N$8  (via drill 0.6)
  Top 0.254: U2.21 66.45,43.91 64.97,45.39 63.3,45.39 v62.54,46.15 | R4.1 66.55,52.6 v62.54,48.59
  Bottom 0.254: v62.54,46.15 v62.54,48.59
N$9
  Top 0.356: LCD1.7 41.26,72.31 36.17,77.39 28,77.39 R5.2
N$10  (via drill 0.6)
  Top 0.356: v43.26,30.22 41.51,30.22 S1.2
  Bottom 0.356: U$1.+ 17.03,40.3 27.1,30.22 v43.26,30.22
N$11  (via drill 0.6)
  Top 0.305: R6.1 C7.2 | R7.2 47.21,76.65 v44.59,74.02 | 62.6,76.65 64.31,78.36 66.03,78.36 | U1.3 30.27,74.04 v30.99,74.04
  Top 0.356: 28.65,72.42 U1.3 | R7.2 62.6,76.65 | 66.03,78.36 R6.1
  Bottom 0.305: v30.99,74.04 31.01,74.02 v44.59,74.02
N$12
  Top 0.305: LCD1.21 51.06,71.2 53.52,73.66 62.32,73.66 C10.1
N$14
  Top 0.254: LED1.3 LED2.1
N$15
  Top 0.254: LED2.3 LED3.1
N$16
  Top 0.254: LED3.3 LED4.1
N$17
  Top 0.254: LED4.3 LED5.1
N$18
  Top 0.254: LED5.3 LED6.1
N$19
  Top 0.254: LED6.3 LED7.1
N$20
  Top 0.254: LED7.3 45.1,45.13 LED8.1
N$21
  Top 0.254: LED9.1 LED8.3
N$22
  Top 0.254: LED10.1 LED9.3
N$23
  Top 0.254: LED11.1 LED10.3
N$24
  Top 0.254: LED12.1 LED11.3
N$25
  Top 0.254: LED13.1 LED12.3
N$26
  Top 0.254: LED14.1 LED13.3
RESET
  Top 0.305: R10.1 37.34,80.9 42.68,75.55 42.68,68.81 LCD1.9
RST  (via drill 0.6)
  Top 0.254: U2.32 63.14,37.25 v63.14,36.25 | R3.1 60.55,37.28 v60.55,35.94 | U2.8 68.45,37.49 68.76,37.49 v70.31,35.94
  Bottom 0.254: v70.31,35.94 70.31,36.4 69.7,37.01 63.6,37.01 63.14,36.55 v63.14,36.25 60.86,36.25 v60.55,35.94
RXI
  Top 0.254: FTDI.3 28.75,25.61 28.75,29.9 36.17,37.31 49.58,37.31 54.07,41.81 U2.25
SCK  (via drill 0.6)
  Top 0.254: U2.9 70.38,38.31 v71.83,36.86 | LCD1.13 45.46,60.13 v46.33,59.26
  Bottom 0.254: v71.83,36.86 70.76,37.92 61.47,37.92 53.85,45.54 53.85,51.74 v46.33,59.26
SD_CLK
  Top 0.254: U3.6 80.49,52.46 R4.2
SD_CS0  (via drill 0.6)
  Top 0.254: U2.20 66.95,45.14 65.53,46.56 v64.64,46.56 | U3.1 77.93,44.73 v77.93,42.55
  Bottom 0.254: v64.64,46.56 67.69,43.51 76.96,43.51 v77.93,42.55
SD_SI  (via drill 0.6)
  Top 0.254: 81.74,50.06 U3.5 81.76,54.51 80.98,55.3 77.93,55.3 v77.78,55.14 | U2.23 65.45,43.08 65.13,43.41 59.94,43.41 v59.69,43.66
  Bottom 0.254: v77.78,55.14 77.17,55.14 77.01,55.14 68.94,47.07 67.26,47.07 64.52,49.81 61.16,49.81 59.69,48.34 v59.69,43.66
SD_SO  (via drill 0.6)
  Top 0.254: U2.22 65.95,43.35 64.67,44.63 v61.34,44.63 | U3.2 79.22,40.69 v79.25,40.67
  Bottom 0.254: v79.25,40.67 73.81,40.67 72.9,41.58 64.39,41.58 v61.34,44.63
TXO
  Top 0.254: U2.26 54.34,41.31 49.58,36.55 36.47,36.55 30.97,31.05 FTDI.2
VIN  (via drill 0.6)
  Top 0.254: 26.72,68.86 30.99,68.86
  Top 0.305: C1.2 54.7,34.05 | 54.41,34.06 R2.2
  Top 0.356: U2.29 U2.30 63.75,39.55 61.13,39.55 R3.2 60.13,39.18 59.49,38.53 59.49,35.24 R2.2 C1.2 | C1.2 C2.2 arc90 52.95,34.06 v51.21,34.06 | 55.22,34.12 C1.2 | LCD1.3 LCD1.4 | C6.2 L1.1 | C6.2 23.87,72.4 U1.4 U1.5 26.03,69.55 26.72,68.86 30.84,68.86 34.34,72.36 38,72.36 38.91,71.45 38.91,69.02 LCD1.4 | LED2.2 5.12,64.4 2.06,67.46 LED1.2 4.01,68.01 4.01,67.95 6.1,70.04 C39.P$2 | LED3.2 11.52,60.7 8.26,63.95 LED2.2 | LED4.2 20.43,56.97 18.03,56.97 14.66,60.35 LED3.2 | LED5.2 26.58,53.62 23.67,53.62 20.7,56.59 LED4.2 | LED6.2 29.63,50.28 29.62,50.27 26.7,53.18 LED5.2 | LED7.2 35.29,46.88 32.74,49.43 LED6.2 | 46.84,44.48 45.92,43.56 41.35,43.56 38.64,46.28 LED7.2 | LED8.2 50.34,44.77 53.08,47.51 LED9.2 | LED9.2 56.24,48.18 56.29,48.13 59.12,50.97 LED10.2 | LED10.2 62.17,51.68 65.01,54.52 LED11.2 | LED11.2 68.12,55.09 71.11,58.08 LED12.2 | LED12.2 74.26,58.59 77.51,61.84 LED13.2 | LED13.2 80.66,62.3 83.71,65.34 LED14.2 84.79,66.93 84.79,67.49 83.41,68.86 82.65,68.86 82.09,69.42 C27.P$2 | U2.1 64.52,37.12 v64.52,35.94 | U2.3 U2.4 66.35,37.45 v66.35,35.94 v66.35,33.35 | U2.17 68.45,46.58 71.93,50.06 75.93,50.06 C25.2 76.01,49.99 U3.8 | 77.9,50.04 U3.8 | S1.1 v41.49,34.56 v41.5,34.57 | U2.11 71.44,39.31 v71.98,38.76 73.51,40.28 73.51,43.1 74.23,43.82 R8.1 76.71,45.6 76.71,46.76 77.95,48.01 U3.8 | C38.P$2 13.35,65.35 10.72,65.35 9.77,64.4 LED2.2 | C37.P$2 19.4,61.85 18.03,61.85 16.88,60.7 LED3.2 | C36.P$2 25.24,58.65 23.98,58.65 22.57,57.24 LED4.2 | C35.P$2 31.18,55.14 29.77,55.14 28.36,53.74 LED5.2 | C34.P$2 37.23,51.64 35.87,51.64 34.51,50.28 LED6.2 | LED7.2 39.79,46.88 41.35,48.44 42.05,48.44 C33.P$2 43.64,49.2 44.09,49.66 44.09,55.91 38.91,61.09 38.91,68.54 LCD1.4
  Top 0.356: LED8.2 48.21,45.85 48.21,46.46 45.62,49.05 C26.P$2 | LED9.2 54.15,49.25 54.15,49.81 52.06,51.9 C32.P$2 | LED10.2 60.25,52.81 60.25,53.31 58.88,54.69 57.96,54.69 57.4,55.25 C31.P$2 | LED11.2 66.04,56.11 66.04,56.67 63.96,58.75 C30.P$2 | LED12.2 72.14,59.62 72.14,60.33 70.92,61.54 69.85,61.54 69.23,62.16 C29.P$2 | LED13.2 78.54,63.33 78.54,63.98 76.55,65.97 C28.P$2 | v46.84,40.06 46.84,44.48 | 46.84,44.48 LED8.2 | R10.2 21.49,80.9 19.96,79.38 19.96,73.62 21.34,72.25 C6.2 | v28.7,32.13 26.57,30 FTDI.4 | U$2.2 U$2.1 14.34,40.85 19.1,36.09 v23.67,36.09
  Bottom 0.356: v66.35,35.94 v64.52,35.94 63.75,35.18 62.08,35.18 60.95,34.05 51.22,34.05 arc-90 v51.21,34.06 49.84,34.06 46.84,37.06 v46.84,40.06 41.5,34.72 v41.5,34.57 31.14,34.57 v28.7,32.13 24.74,36.09 v23.67,36.09 | v71.98,38.76 72.06,38.84 73.05,38.84 73.81,38.07 73.81,37.01 70.16,33.35 v66.35,33.35 | FTDI.4
(copper drawn outside any net)
  shapes: Bottom area x464, Top area x1655

### Text on the board
tPlace: ON | GND | VCC | TXO | RXI | OFF
Reference: Rev 1.1 Changes / -Removed shorts on crystal and DC / -Added pull-down resistor for GPIO15 / -Made hole bigger / -Added GND via stitching / -Changed silkscreen on front and back / -Corrected feed line for antenna / -Removed C8 from 12V output voltage / -Changed Battery Location | Antenna 50 ohm feed line: / - er = 4 / - Trace Width = 57 mils / - Spacing = 8 mils / - PCB Thickness = 1.6 mm